# EAGLE schematic Addon-mapleCUx_OneWire-RS485-008 (EAGLE 7.6.0)
MAPLE-CUx Large Version
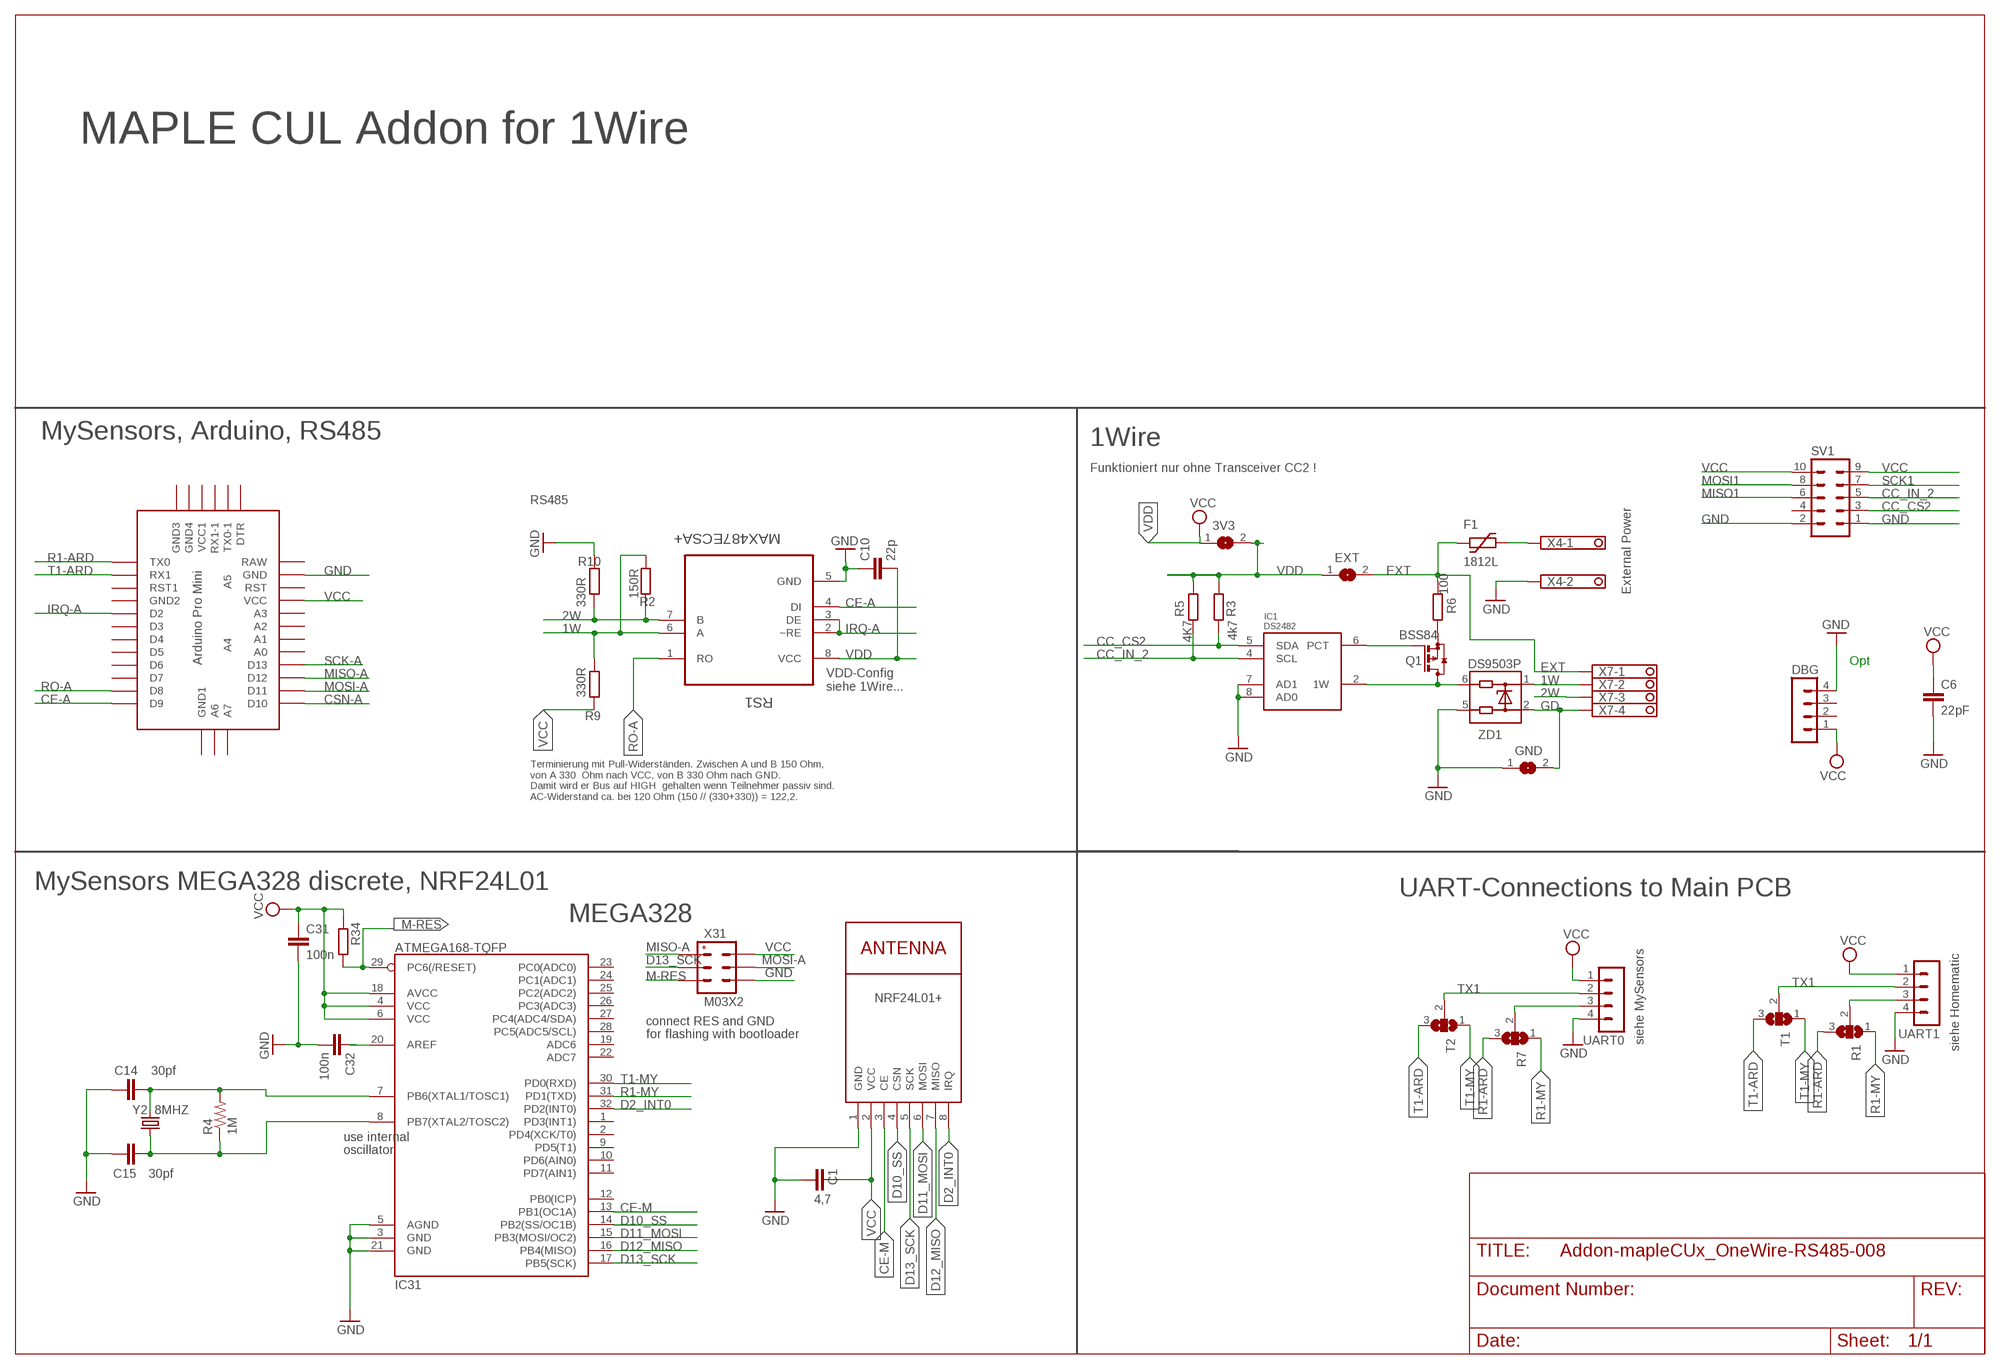
[diagram p0: schematic, sheet 1]

## Parts
3V3  SJ  [SJ]
C1  4,7  C-EUC1210  [C1210]
C6  22pF  C-EUC0805  [C0805]
C10  22p  C-EUC0805  [C0805]
C14  30pf  CAP0805  [0805]
C15  30pf  CAP0805  [0805]
C31  100n  C-EUC0805  [C0805]
C32  100n  C-EUC0805  [C0805]
DBG  MA04-1  [MA04-1]
EXT  SJ  [SJ]
F1  1812L  [1812L]
GND  SJ  [SJ]
IC1  DS2482  DS2482-100S  [SO08]
IC31  ATMEGA168-TQFP  [TQFP32-08]
NRF24L01+  NRF24L01+  WIRELESS-NRF24L01  [WIRELESS-NRF24L01]
Q1  BSS84  [SOT23]
R1  SJ2W  [SJ_2]
R2  150R  R-EU_R0805  [R0805]
R3  4k7  R-EU_R0805  [R0805]
R4  1M  RESISTOR0805-RES  [0805]
R5  4K7  R-EU_R0805  [R0805]
R6  100  R-EU_R0805  [R0805]
R7  SJ2W  [SJ_2]
R9  330R  R-EU_R0805  [R0805]
R10  330R  R-EU_R0805  [R0805]
R34  R-EU_R0805  [R0805]
RS1  MAX487ECSA+  [SOIC127P600X175-8N]
SV1  MA05-2  [MA05-2]
T1  SJ2W  [SJ_2]
T2  SJ2W  [SJ_2]
U$1  ABK-PRO-MINI  [ABK-PRO-MINI]
UART0  MA04-1  [MA04-1]
UART1  MA04-1  [MA04-1]
X4  1751248  [1751248]
X7  1751264  [1751264]
X31  M03X2  [2X03-1.27MM_SMD]
Y2  8MHZ  CRYSTALTXC-7A  [CRYSTAL-TXC-7A]
ZD1  DS9503P  [TSOC6]

## Nets
1W: R2.1 R9.2 RS1.6(A) X7.2 ZD1.1
2W: R2.2 R10.1 RS1.7(B) X7.3
CC_CS2: IC1.5(SDA) R3.2 SV1.3
CC_IN_2: IC1.4(SCL) R5.2 SV1.5
CE-A: RS1.4(DI) U$1.D9
CE-M: IC31.13(PB1(OC1A)) NRF24L01+.3(CE)
CSN-A: U$1.D10
D2_INT0: IC31.32(PD2(INT0)) NRF24L01+.8(IRQ)
D10_SS: IC31.14(PB2(SS/OC1B)) NRF24L01+.4(CSN)
D11_MOSI: IC31.15(PB3(MOSI/OC2)) NRF24L01+.6(MOSI)
D12_MISO: IC31.16(PB4(MISO)) NRF24L01+.7(MISO)
D13_SCK: IC31.17(PB5(SCK)) NRF24L01+.5(SCK) X31.P$3
EXT [PWR]: EXT.2 F1.P$1 R6.2 X7.1
GD [PWR]: GND.2 X7.4 ZD1.2
GND [PWR]: C1.1 C6.2 C10.1 C14.1 C15.1 C31.2 C32.2 DBG.4 GND.1 IC1.7(AD1) IC1.8(AD0) IC31.3(GND) IC31.5(AGND) IC31.21(GND) NRF24L01+.1(GND) R10.2 RS1.5(GND) SV1.1 SV1.2 U$1.GND UART0.4 UART1.4 X4.2 X31.P$6 ZD1.5
IRQ-A: RS1.2(~RE) RS1.3(DE) U$1.D2
M-RES: IC31.29(PC6(/RESET)) R34.2 X31.P$5
MISO1: SV1.6
MISO-A: U$1.D12 X31.P$1
MOSI1: SV1.8
MOSI-A: U$1.D11 X31.P$4
N$3: C14.2 IC31.7(PB6(XTAL1/TOSC1)) R4.2 Y2.P$2
N$13: C32.1 IC31.20(AREF)
N$19: C15.2 IC31.8(PB7(XTAL2/TOSC2)) R4.1 Y2.P$1
N$45 [PWR]: F1.P$2 X4.1
N$47: IC1.6(PCT) Q1.1(G)
N$48: IC1.2(1W) Q1.3(D) ZD1.6
N$52: Q1.2(S) R6.1
R1-ARD: R1.3 R7.3 U$1.TX0
R1-MY: IC31.31(PD1(TXD)) R1.1 R7.1
RO-A: RS1.1(RO) U$1.D8
RX1: R1.2 R7.2 UART0.3 UART1.3
SCK1: SV1.7
SCK-A: U$1.D13
T1-ARD: T1.3 T2.3 U$1.RX1
T1-MY: IC31.30(PD0(RXD)) T1.1 T2.1
TX1: T1.2 T2.2 UART0.2 UART1.2
VCC [PWR]: C1.2 C6.1 C31.1 DBG.1 IC31.4(VCC) IC31.6(VCC) IC31.18(AVCC) R9.1 R34.1 SV1.9 SV1.10 U$1.VCC UART0.1 UART1.1 X31.P$2
VDD [PWR]: 3V3.1 3V3.2 C10.2 EXT.1 R3.1 R5.1 RS1.8(VCC) ; supply symbol labelled VCC
Unconnected: DBG.2 DBG.3 IC31.1(PD3(INT1)) IC31.2(PD4(XCK/T0)) IC31.9(PD5(T1)) IC31.10(PD6(AIN0)) IC31.11(PD7(AIN1)) IC31.12(PB0(ICP)) IC31.19(ADC6) IC31.22(ADC7) IC31.23(PC0(ADC0)) IC31.24(PC1(ADC1)) IC31.25(PC2(ADC2)) IC31.26(PC3(ADC3)) IC31.27(PC4(ADC4/SDA)) IC31.28(PC5(ADC5/SCL)) SV1.4 U$1.A0 U$1.A1 U$1.A2 U$1.A3 U$1.A4 U$1.A5 U$1.A6 U$1.A7 U$1.D3 U$1.D4 U$1.D5 U$1.D6 U$1.D7 U$1.DTR U$1.GND1(GND2) U$1.GND2(GND3) U$1.GND3(GND4) U$1.GND4(GND1) U$1.RAW U$1.RST U$1.RST1 U$1.RX1-1 U$1.TX0-1 U$1.VCC1

## Notes on the sheet
- MAPLE CUL Addon for 1Wire
- MySensors, Arduino, RS485 | 1Wire
- Funktioniert nur ohne Transceiver CC2 !
- RS485
- External Power
- Opt
- VDD-Config
  siehe 1Wire...
- Terminierung mit Pull-Widerständen. Zwischen A und B 150 Ohm,
  von A 330  Ohm nach VCC, von B 330 Ohm nach GND. 
  Damit wird er Bus auf HIGH  gehalten wenn Teilnehmer passiv sind.
  AC-Widerstand ca. bei 120 Ohm (150 // (330+330)) = 122,2.
- MySensors MEGA328 discrete, NRF24L01 | UART-Connections to Main PCB
- MEGA328
- connect RES and GND
- for flashing with bootloader
- siehe MySensors
- siehe Homematic
- use internal
- oscillator

## Power pins joined to a net without a drawn wire
GND: IC1.3(GND)
VCC: NRF24L01+.2(VCC)
VDD: IC1.1(VDD)

## Library data of the parts
3V3 EXT GND = jumper:SJ: SMD solder JUMPER
C1 C6 C10 C31 C32 = rcl:C-EU: CAPACITOR, European symbol
C14 C15 = doug:CAP: Capacitor Standard 0603 ceramic capacitor, and 0.1" leaded capacitor.
DBG UART0 UART1 = con-lstb:MA04-1: PIN HEADER; OC_FARNELL: unknown; OC_NEWARK: unknown
F1 = ptc-littlefuse:1812L
IC1 = 1wire:DS2482-100: I2C to 1-Wire Host Adapter/Line Driver This device is a onewire host and I2C interface in one chip. It provides the complete DC/AC requirements for onewire communication, including overdrive speed mode, but, unlike the DS2480B chip, no 12V EPROM programming. Notes: For overdrive speed and 5V EEPROM programming, an external active pullup circuit must be connected to the 1W, VDD and PCT pin. See the datasheet for details. The lower two I2C adress bits of the chip can be selected by external pins, so up to 4 chips may be connected to the same I2C bus. Author: Orginal device and description from Giovanni Varasano <giovanni.varasano@fastwebnet.it> Improved by Jan Kandziora <jjj@gmx.de>
IC31 = atmel:ATMEGA168: Atmel Atmega 168/328/328P
NRF24L01+ = diy-modules:WIRELESS-NRF24L01: 2.4 GHz Wireless Module based on NRF24L01 chip
Q1 = transistor-small-signal:BSS84: P-CHANNEL MOS FET
R1 R7 T1 T2 = jumper:SJ2W: SMD solder JUMPER
R2 R3 R5 R6 R9 R10 R34 = rcl:R-EU_: RESISTOR, European symbol
R4 = doug:RESISTOR: Resistor Basic schematic elements and footprints for 0603, 1206, and PTH resistors.
RS1 = Maxim_By_element14_Batch_1:MAX487ECSA+: Low-Power, Slew-Rate-Limited RS-485/RS-422 Transceivers; MPN: MAX487ECSA+; OC_FARNELL: 9724532; OC_NEWARK: 68K4803; PACKAGE: SOIC-8; SUPPLIER: Maxim
SV1 = con-lstb:MA05-2: PIN HEADER; OC_FARNELL: unknown; OC_NEWARK: unknown
U$1 = Arduino-clone:ABK-PRO-MINI: ABK Pro-Mini Arduino Clone
X4 = con-phoenix-350:1751248: MKDS 1/ 2-3,5 Printklemme Nennstrom: 10 A Bemessungsspannung: 160 V Raster: 3,5 mm Polzahl: 2 Montageart: Löten Anschlussart: Schraubanschluss Anschlussrichtung vom Leiter zur Platine: 0° Source: http://eshop.phoenixcontact.com .. 1751248.pdf; OC_FARNELL: unknown; OC_NEWARK: unknown
X7 = con-phoenix-350:1751264: MKDS 1/ 4-3,5 Printklemme Nennstrom: 10 A Bemessungsspannung: 160 V Raster: 3,5 mm Polzahl: 4 Montageart: Löten Anschlussart: Schraubanschluss Anschlussrichtung vom Leiter zur Platine: 0° Source: http://eshop.phoenixcontact.com .. 1751264.pdf; MPN: 1751264; OC_FARNELL: unknown; OC_NEWARK: 10R0934
X31 = mechanics:M03X2
Y2 = SparkFun-FreqCtrl:CRYSTAL: Various standard crystals. Proven footprints.
ZD1 = 1wire:DS9503: ESD Protection Diode with Resistors This ESD protection diode is designed especially for onewire host interfaces. Unlike the DS9502, it has two additional 5Ohm resitors in the 1W and GND line. Pin 5 and 6 have to be connected to the host side, pin 1 und 2 to the network side. The 1W line is through pin 1 and 6, the GND line is through pin 2 and 5. Author: Jan Kandziora <jjj@gmx.de>

## Net classes
0 default: width 0.305 mm
1 PWR: width 0.457 mm